# Altium schematic sheet Power_module.SchDoc
size A4
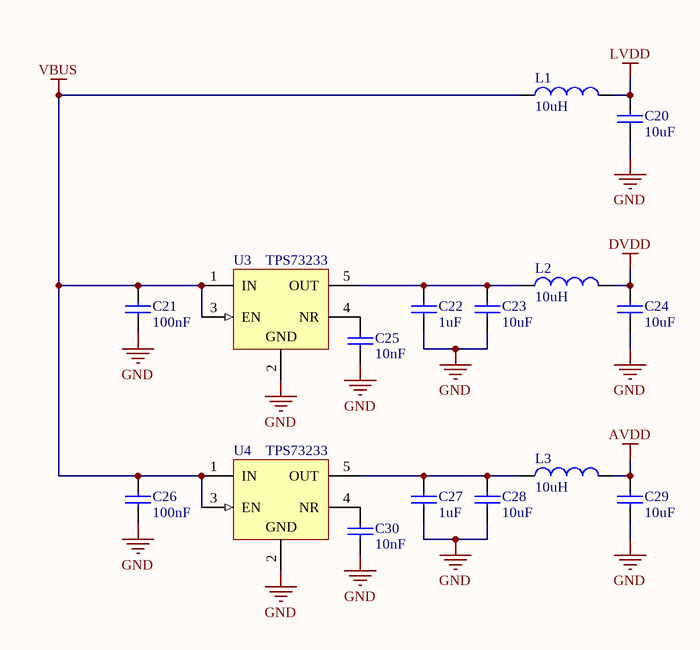
[diagram p0: Power_module.SchDoc]

## Parts
C20  value 10uF  [6-0805_M]  (hidden comment: Cap)
C21  value 100nF  [6-0805_M]  (hidden comment: Cap)
C22  value 1uF  [6-0805_M]  (hidden comment: Cap)
C23  value 10uF  [6-0805_M]  (hidden comment: Cap)
C24  value 10uF  [6-0805_M]  (hidden comment: Cap)
C25  value 10nF  [6-0805_M]  (hidden comment: Cap)
C26  value 100nF  [6-0805_M]  (hidden comment: Cap)
C27  value 1uF  [6-0805_M]  (hidden comment: Cap)
C28  value 10uF  [6-0805_M]  (hidden comment: Cap)
C29  value 10uF  [6-0805_M]  (hidden comment: Cap)
C30  value 10nF  [6-0805_M]  (hidden comment: Cap)
L1  value 10uH  [6-0805_M]  (hidden comment: Inductor)
L2  value 10uH  [6-0805_M]  (hidden comment: Inductor)
L3  value 10uH  [6-0805_M]  (hidden comment: Inductor)
U3  TPS73233  [TI-DBV5_N]
U4  TPS73233  [TI-DBV5_N]

## Nets
AVDD: C29.2 L3.2
DVDD: C24.2 L2.2
GND: C20.1 C21.1 C22.1 C23.1 C24.1 C25.1 C26.1 C27.1 C28.1 C29.1 C30.1 U3.2(GND) U4.2(GND)
LVDD: C20.2 L1.2
VBUS: C21.2 C26.2 L1.1 U3.1(IN) U3.3(EN) U4.1(IN) U4.3(EN)
NetC22_2: C22.2 C23.2 L2.1 U3.5(OUT)
NetC25_2: C25.2 U3.4(NR)
NetC27_2: C27.2 C28.2 L3.1 U4.5(OUT)
NetC30_2: C30.2 U4.4(NR)

## Library data of the parts
C20-C30 = Cap: Capacitor; Published: 8-Jun-2000; LatestRevisionDate: 17-Jul-2002; LatestRevisionNote: Re-released for DXP Platform.; PackageReference: RAD-0.3; Publisher: Altium Limited; PackageDescription: Radial Cap, Thru-Hole; 2 Leads; 0.3 in Pin Spacing
L1-L3 = Inductor: Code_IEC: 1005; Published: 8-Jun-2000; LatestRevisionDate: 29-May-2009; LatestRevisionNote: IPC-7351 Footprint Added.; PackageReference: 0402-A; Publisher: Altium Limited; PackageDescription: Chip Inductor; Code_JEITA: 0402
U3 U4 = TPS73233DBVT: Single Output Fast Transient Response LDO, 200 mA, Fixed 3.3 V Output, 1.7 to 5.5 V Input, with Reverse Current Protection, 5-pin SOT-23 (DBV), -40 to 85 degC, Green (RoHS & no Sb/Br); Manufacturer: Texas Instruments; Accuracy(%): 1; Fixed Output Options(V): 3.3; Iout(Max)(A): 0.25; Iq(Typ)(mA): 0.4; SubFamily: Single Channel LDO; Vdo(Typ)(mV): 40; Vin(Max)(V): 5.5; Vin(Min)(V): 1.7; DatasheetVersion: SBVS037O; PackageVersion: 4073253-4/K; PackageReference: DBV5; PackageDescription: 5-Pin Plastic Small Outline, Body 1.60 Ã— 2.90 mm, Pitch 0.95 mm; Supplier 1: Digi-Key; Supplier Part Number 1: 296-15812-2-ND; Supplier 2: Digi-Key; Supplier Part Number 2: 296-15812-1-ND; Supplier 3: Digi-Key; Supplier Part Number 3: 296-15812-6-ND; Supplier 4: Newark; Supplier Part Number 4: 87H2968; Supplier 5: Mouser; Supplier Part Number 5: 595-TPS73233DBVT; Eco-Plan: Green (RoHS & no Sb/Br); Vout Adj(Max)(V): 3.3; Vout Adj(Min)(V): 3.3; Mounting Technology: Surface Mount; Code_JEDEC: MO-178; PartNumber: TPS73233DBVT; ComponentLink1Description: Manufacturer URL; ComponentLink1URL: http://www.ti.com/; ComponentLink2Description: Datasheet; ComponentLink2URL: http://www.ti.com/general/docs/lit/getliterature.tsp?genericPartNumber=TPS73233&fileType=pdf; ComponentLink3Description: Package Specification; ComponentLink3URL: http://www.ti.com/litv/pdf/mpds018i